# EAGLE design okenkovy diskriminator (EAGLE 7.7.0)
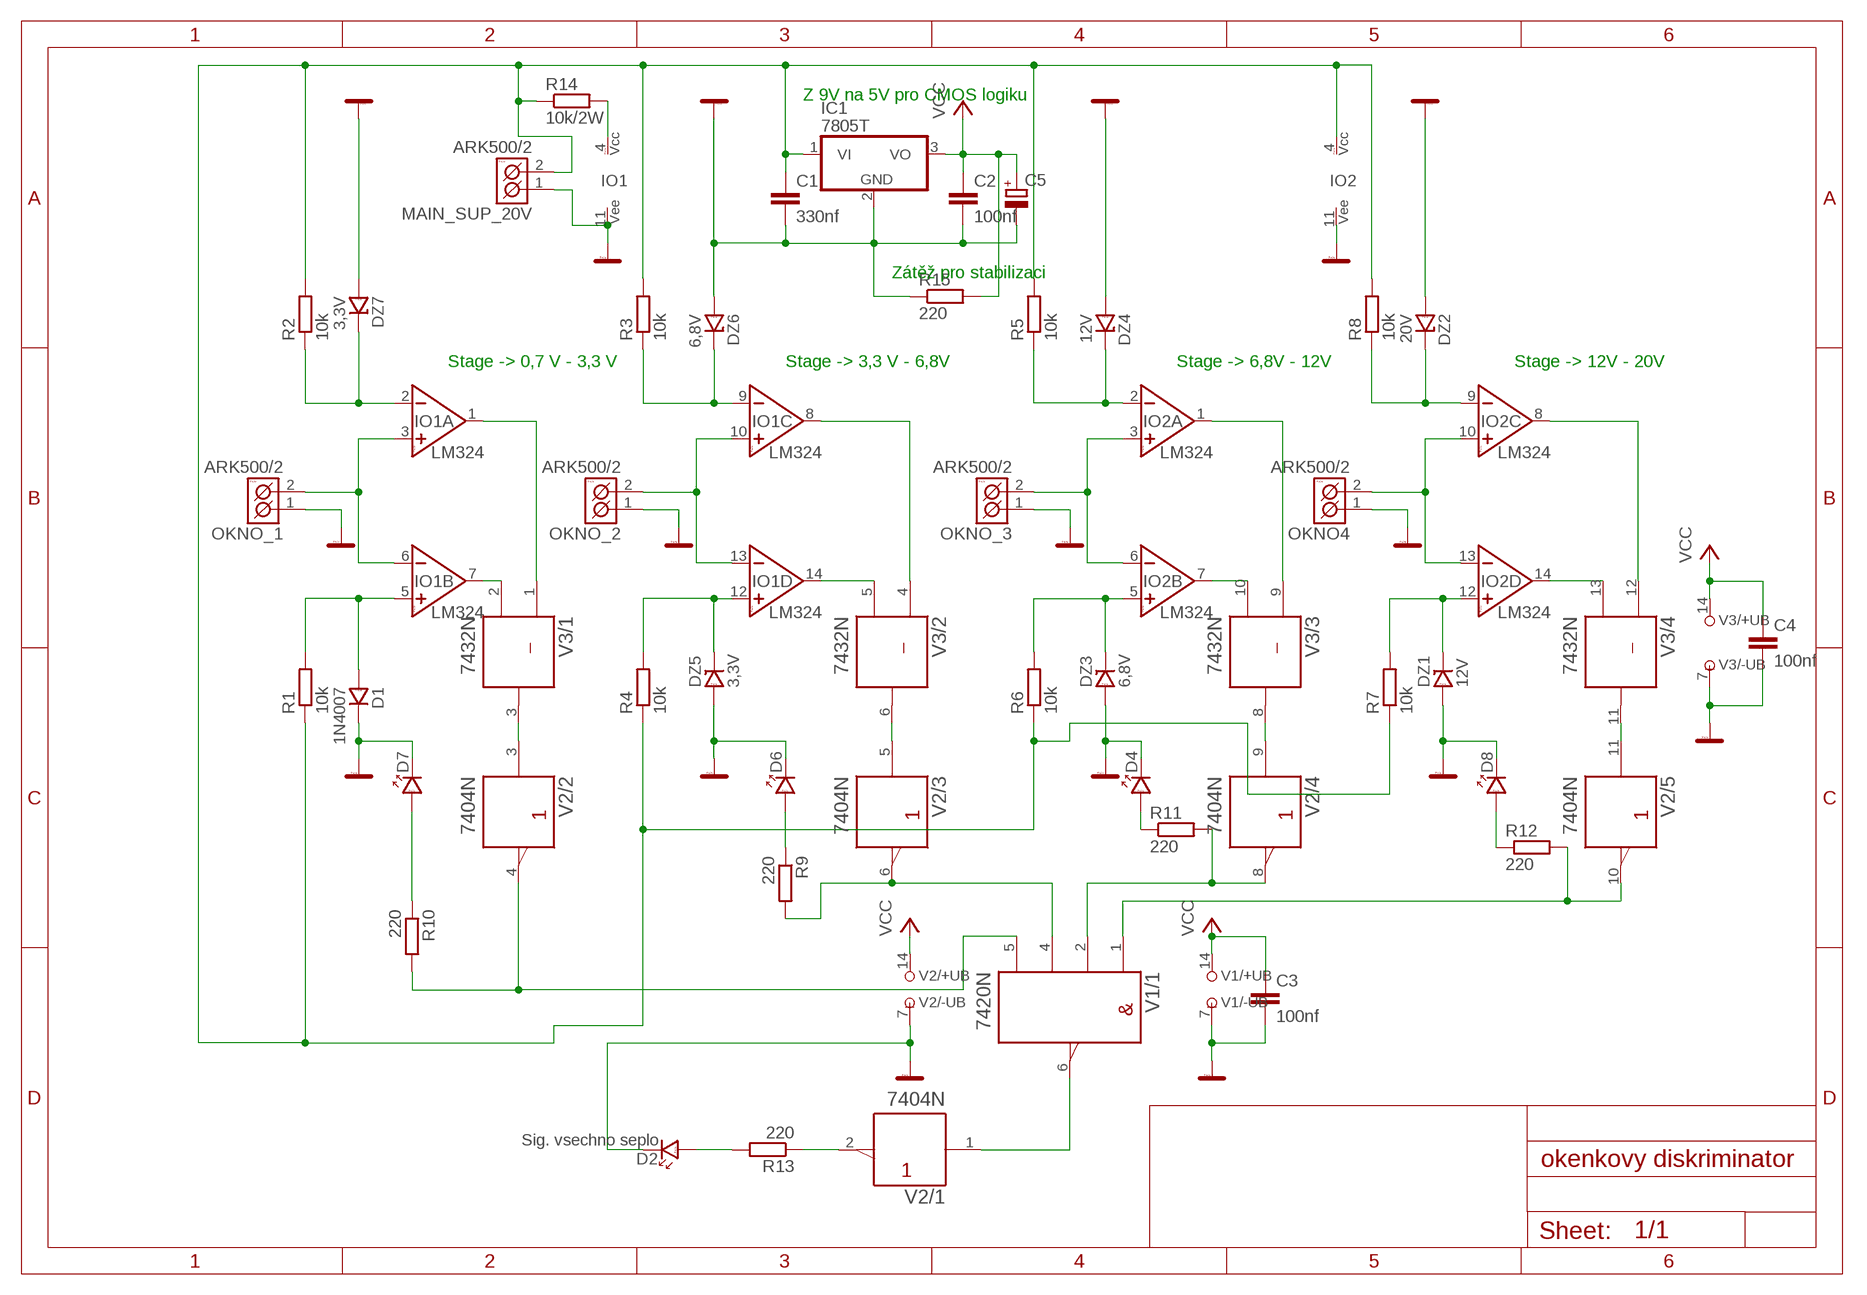
[diagram p0: schematic, sheet 1]

## Parts
C1  330nf  C-EU050-030X075  [C050-030X075]
C2  100nf  C-EU050-030X075  [C050-030X075]
C3  100nf  C-EU050-025X075  [C050-025X075]
C4  100nf  C-EU050-025X075  [C050-025X075]
C5  CPOL-EUE2.5-5  [E2,5-5]
D1  1N4007  [DO41]
D2  Sig. vsechno seplo  LED_5  [LED_5]
D4  LED_5  [LED_5]
D6  LED_5  [LED_5]
D7  LED_5  [LED_5]
D8  LED_5  [LED_5]
DZ1  12V  D-BZX85V_1,3W-ZENER  [DO35]
DZ2  20V  D-BZX85V_1,3W-ZENER  [DO35]
DZ3  6,8V  D-BZX85V_1,3W-ZENER  [DO35]
DZ4  12V  D-BZX85V_1,3W-ZENER  [DO35]
DZ5  3,3V  D-BZX85V_1,3W-ZENER  [DO35]
DZ6  6,8V  D-BZX85V_1,3W-ZENER  [DO35]
DZ7  3,3V  D-BZX85V_1,3W-ZENER  [DO35]
IC1  7805T  [TO220H]
IO1  LM324  [DIL14]
IO2  LM324  [DIL14]
MAIN_SUP_20V  ARK500/2  [ARK500/2]
OKNO4  ARK500/2  [ARK500/2]
OKNO_1  ARK500/2  [ARK500/2]
OKNO_2  ARK500/2  [ARK500/2]
OKNO_3  ARK500/2  [ARK500/2]
R1  10k  R-EU_0207/10  [0207/10]
R2  10k  R-EU_0207/10  [0207/10]
R3  10k  R-EU_0207/10  [0207/10]
R4  10k  R-EU_0207/10  [0207/10]
R5  10k  R-EU_0207/10  [0207/10]
R6  10k  R-EU_0207/10  [0207/10]
R7  10k  R-EU_0207/10  [0207/10]
R8  10k  R-EU_0207/10  [0207/10]
R9  220  R-EU_0207/10  [0207/10]
R10  220  R-EU_0207/10  [0207/10]
R11  220  R-EU_0207/10  [0207/10]
R12  220  R-EU_0207/10  [0207/10]
R13  220  R-EU_0207/10  [0207/10]
R14  10k/2W  R-EU_0414/15  [0414/15]
R15  220  R-EU_0207/10  [0207/10]
V1  7420N  [DIL14]
V2  7404N  [DIL14]
V3  7432N  [DIL14]

## Nets
GND: C1.2 C2.2 C3.2 C4.2 C5.- D1.K D2.K D4.K D6.K D7.K D8.K DZ1.A DZ2.A DZ3.A DZ4.A DZ5.A DZ6.A DZ7.A IC1.2(GND) IO1.11(POWER:VEE) IO2.11(POWER:VEE) MAIN_SUP_20V.1(K1) OKNO4.1(K1) OKNO_1.1(K1) OKNO_2.1(K1) OKNO_3.1(K1) R15.1 V1.7(/-UB:-UB) V2.7(/-UB:-UB) V3.7(/-UB:-UB)
N$1: D1.A IO1.5(B:NEIN+) R1.2
N$2: DZ7.K IO1.2(A:IN-) R2.1
N$3: DZ6.K IO1.9(C:IN-) R3.1
N$4: DZ5.K IO1.12(D:NEIN+) R4.2
N$5: DZ3.K IO2.5(B:NEIN+) R6.2
N$6: DZ4.K IO2.2(A:IN-) R5.1
N$7: DZ1.K IO2.12(D:NEIN+) R7.2
N$8: DZ2.K IO2.9(C:IN-) R8.1
N$9: IO1.3(A:NEIN+) IO1.6(B:IN-) OKNO_1.2(K2)
N$10: IO1.10(C:NEIN+) IO1.13(D:IN-) OKNO_2.2(K2)
N$11: IO2.3(A:NEIN+) IO2.6(B:IN-) OKNO_3.2(K2)
N$12: IO2.10(C:NEIN+) IO2.13(D:IN-) OKNO4.2(K2)
N$13: IO1.1(A:VYSTUP) V3.1(/1:A)
N$14: D7.A R10.1
N$15: IO1.7(B:VYSTUP) V3.2(/1:B)
N$16: D6.A R9.1
N$17: IO1.8(C:VYSTUP) V3.4(/2:A)
N$18: D4.A R11.1
N$19: IO1.14(D:VYSTUP) V3.5(/2:B)
N$20: D8.A R12.1
N$21: IO2.1(A:VYSTUP) V3.9(/3:A)
N$22: R13.1 V2.2(/1:Y)
N$23: IO2.7(B:VYSTUP) V3.10(/3:B)
N$24: D2.A R13.2
N$25: IO2.8(C:VYSTUP) V3.12(/4:A)
N$27: IO2.14(D:VYSTUP) V3.13(/4:B)
N$28: V2.11(/5:A) V3.11(/4:Y)
N$29: V2.9(/4:A) V3.8(/3:Y)
N$30: R9.2 V1.4(/1:C) V2.6(/3:Y)
N$31: V2.5(/3:A) V3.6(/2:Y)
N$32: R10.2 V1.5(/1:D) V2.4(/2:Y)
N$33: IO1.4(POWER:VCC) R14.2
N$34: R11.2 V1.2(/1:B) V2.8(/4:Y)
N$35: R12.2 V1.1(/1:A) V2.10(/5:Y)
N$36: V2.3(/2:A) V3.3(/1:Y)
N$37: V1.6(/1:Y) V2.1(/1:A)
N$38: C1.1 IC1.1(VI) IO2.4(POWER:VCC) MAIN_SUP_20V.2(K2) R1.1 R2.2 R3.2 R4.1 R5.2 R6.1 R7.1 R8.2 R14.1
VCC: C2.1 C3.1 C4.1 C5.+ IC1.3(VO) R15.2 V1.14(/+UB:+UB) V2.14(/+UB:+UB) V3.14(/+UB:+UB)
Unconnected: V1.8(/2:Y) V1.9(/2:A) V1.10(/2:B) V1.12(/2:C) V1.13(/2:D) V2.12(/6:Y) V2.13(/6:A)

## Notes on the sheet
- Z 9V na 5V pro CMOS logiku
- Zátěž pro stabilizaci
- Stage -> 0,7 V - 3,3 V | Stage -> 3,3 V - 6,8V | Stage -> 6,8V - 12V | Stage -> 12V - 20V

## Library data of the parts
C1-C4 = rcl:C-EU: CAPACITOR, European symbol
C5 = rcl:CPOL-EU: POLARIZED CAPACITOR, European symbol
D1 = #PaJa_31:1N4007: Usmernovaci dioda - 1A, 1000V
D2 D4 D6-D8 = #PaJa_31:LED: LED - jednobarevna
DZ1-DZ7 = #PaJa_31:D-?-ZENER: Zenerova dioda
IC1 = linear:78*: Positive VOLTAGE REGULATOR Source: http://cache.national.com/ds/LM/LM78L05.pdf http://www.fairchildsemi.com/ds/LM/LM7805.pdf
IO1 IO2 = #PaJa_31:LM324: OZ - 4x, bipolární
MAIN_SUP_20V OKNO4 OKNO_1-OKNO_3 = #PaJa_konektory:ARK500/2: Svorkovnice - roztec 5mm - dvojita
R1-R15 = rcl:R-EU_: RESISTOR, European symbol
V1 = 74ttl-din:74*20: Dual 4-input NAND gate
V2 = 74ttl-din:74*04: Hex INVERTER
V3 = 74ttl-din:74*32: Quad 2-input OR gate

## Board
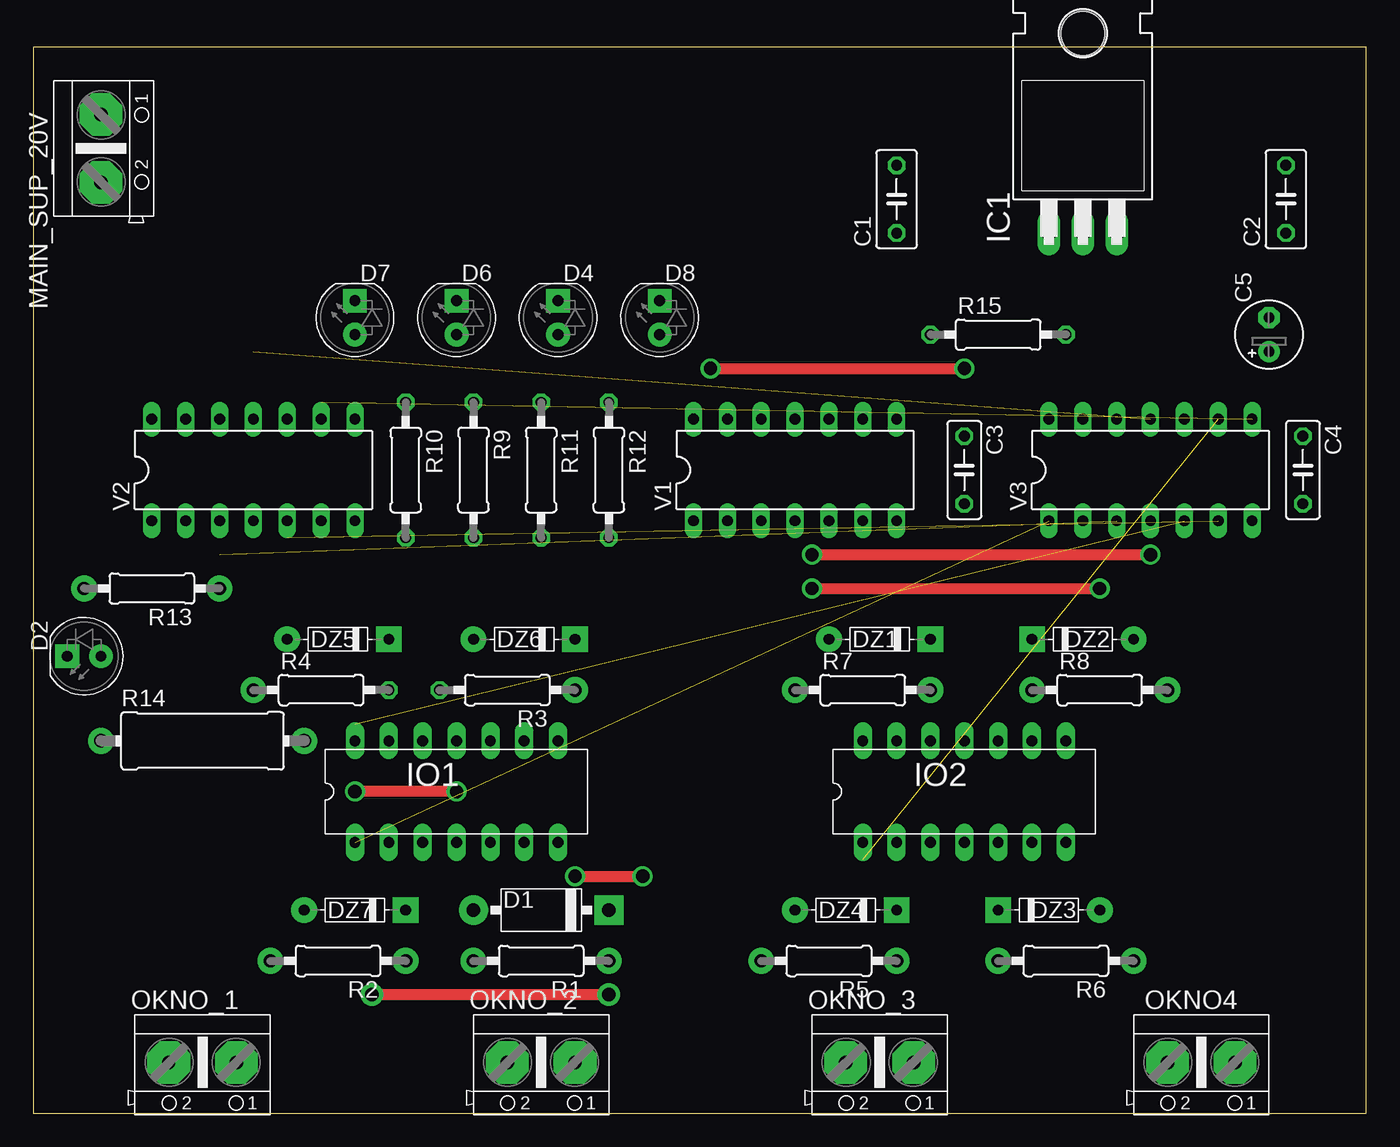
[diagram p1: board, top side]
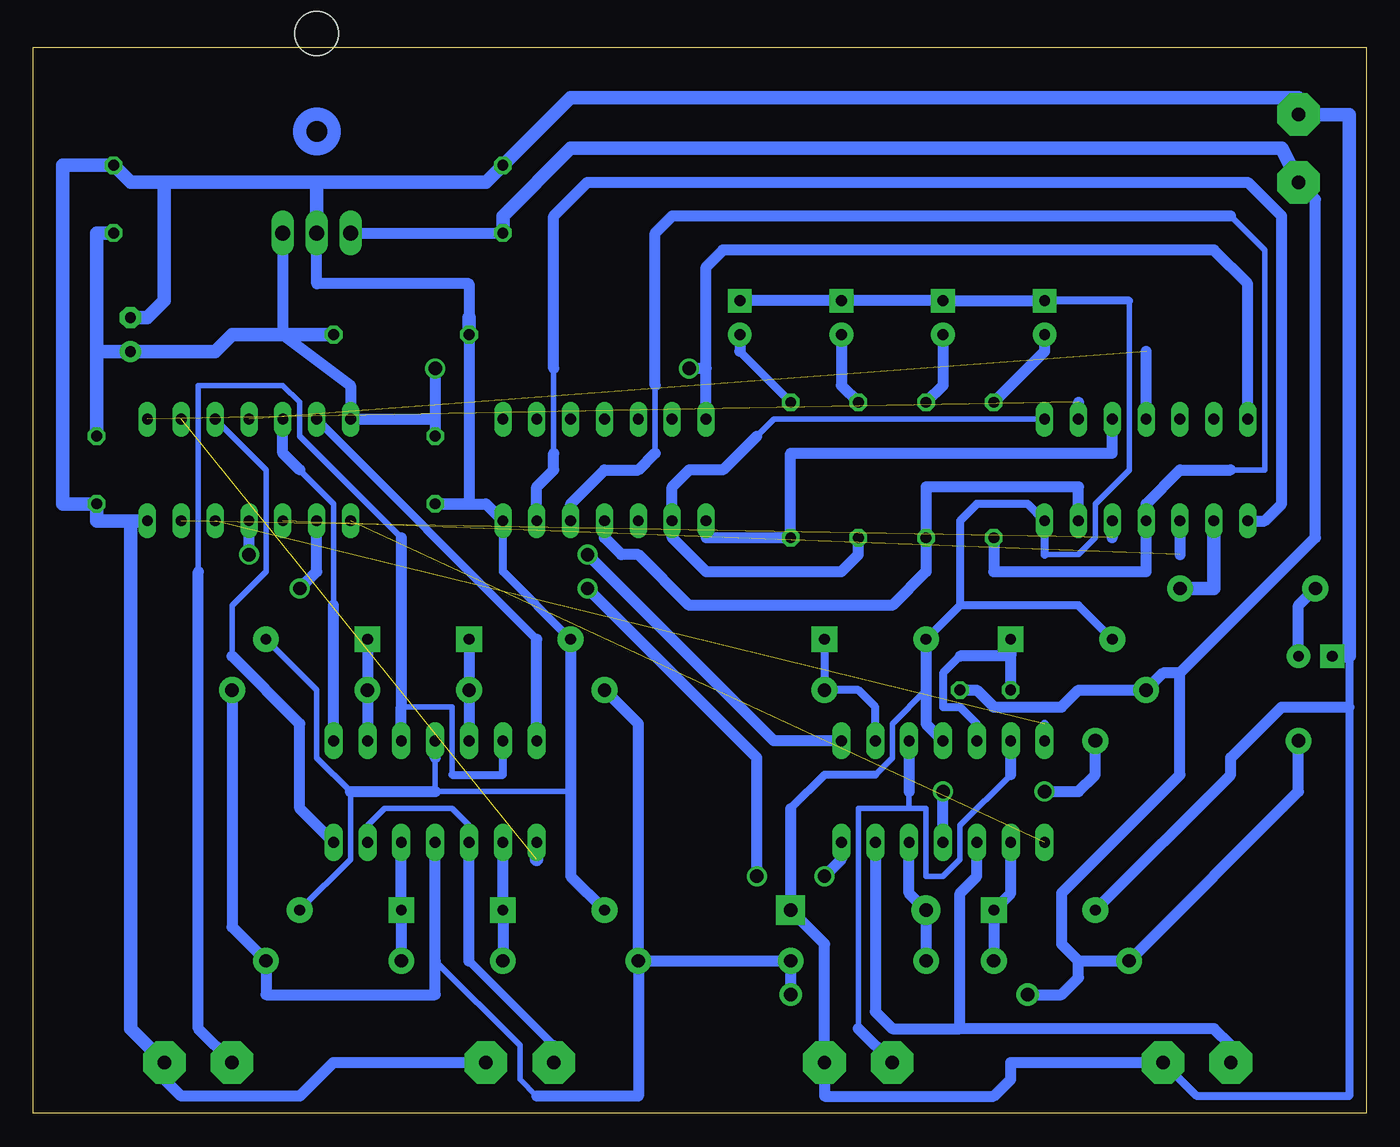
[diagram p2: board, bottom side, seen from below]

Size 100 x 80 mm. Coordinates in mm from the lower left corner, seen from the top.
Outline: 0,0 100,0 100,80 0,80 0,0
Copper layers (1*16): Top 0.035mm / dielectric 1.5mm / Bottom 0.035mm
Design rules "default": minimum track width 10mil, minimum drill 24mil, track to track 8mil, track to pad 8mil, pad to pad 8mil, via to via 8mil, smd to smd 8mil, copper to edge 40mil, drill to drill 8mil, minimum pad ring 10mil, minimum via ring 8mil, stop-mask expansion 4mil, vias tented up to drill 0mil, thermal gap 10mil

### Footprints (pad centres in the part's own frame; a part is rotated, then mirrored left to right if it is on the bottom)
C050-030X075 = drill 0.813 octagon: 1 -2.54,0; 2 2.54,0
C050-025X075 = drill 0.813 octagon: 1 -2.54,0; 2 2.54,0
E2,5-5 = drill 0.813 pad 1.6: + -1.27,0 | drill 0.813 pad 1.6 octagon: - 1.27,0
DO41 = drill 1.016 pad 2.184: A -5.08,0 | drill 1.016 pad 2.184 square: K 5.08,0
LED_5 = drill 0.813 pad 1.778: A -1.27,0 | drill 0.813 pad 1.778 square: K 1.27,0
DO35 = drill 0.813 pad 1.93: A -3.81,0 | drill 0.813 pad 1.93 square: K 3.81,0
TO220H = drill 1.118 long: 1 -2.54,-10.16; 2 0,-10.16; 3 2.54,-10.16 | hole 3.302: 0,4.826
DIL14 = drill 0.813 pad 1.4 long: 1 -7.62,-3.81; 2 -5.08,-3.81; 3 -2.54,-3.81; 4 0,-3.81; 5 2.54,-3.81; 6 5.08,-3.81; 7 7.62,-3.81; 8 7.62,3.81; 9 5.08,3.81; 10 2.54,3.81; 11 0,3.81; 12 -2.54,3.81; 13 -5.08,3.81; 14 -7.62,3.81
ARK500/2 = drill 1 pad 3.2 octagon: 1 -2.54,0; 2 2.54,0
0207/10 = drill 0.813 octagon: 1 -5.08,0; 2 5.08,0
0414/15 = drill 1.016 octagon: 1 -7.62,0; 2 7.62,0
DIL14' = drill 0.813 long: 1 -7.62,-3.81; 2 -5.08,-3.81; 3 -2.54,-3.81; 4 0,-3.81; 5 2.54,-3.81; 6 5.08,-3.81; 7 7.62,-3.81; 8 7.62,3.81; 9 5.08,3.81; 10 2.54,3.81; 11 0,3.81; 12 -2.54,3.81; 13 -5.08,3.81; 14 -7.62,3.81

### Placement (x,y rotation side)
C1  64.77,68.58 90 top
C2  93.98,68.58 90 top
C3  69.85,48.26 270 top
C4  95.25,48.26 270 top
C5  92.71,58.42 90 top
D1  38.1,15.24 0 top
D2  3.81,34.29 180 top
D4  39.37,59.69 90 top
D6  31.75,59.69 90 top
D7  24.13,59.69 90 top
D8  46.99,59.69 90 top
DZ1  63.5,35.56 0 top
DZ2  78.74,35.56 180 top
DZ3  76.2,15.24 180 top
DZ4  60.96,15.24 0 top
DZ5  22.86,35.56 0 top
DZ6  36.83,35.56 0 top
DZ7  24.13,15.24 0 top
IC1  78.74,76.2 0 top
IO1  31.75,24.13 0 top
IO2  69.85,24.13 0 top
MAIN_SUP_20V  5.08,72.39 270 top
OKNO4  87.63,3.81 180 top
OKNO_1  12.7,3.81 180 top
OKNO_2  38.1,3.81 180 top
OKNO_3  63.5,3.81 180 top
R1  38.1,11.43 180 top
R2  22.86,11.43 180 top
R3  35.56,31.75 180 top
R4  21.59,31.75 0 top
R5  59.69,11.43 180 top
R6  77.47,11.43 180 top
R7  62.23,31.75 0 top
R8  80.01,31.75 0 top
R9  33.02,48.26 270 top
R10  27.94,48.26 270 top
R11  38.1,48.26 270 top
R12  43.18,48.26 270 top
R13  8.89,39.37 180 top
R14  12.7,27.94 0 top
R15  72.39,58.42 0 top
V1  7420N  [DIL14']  57.15,48.26 0 top
V2  7404N  [DIL14']  16.51,48.26 0 top
V3  7432N  [DIL14']  83.82,48.26 0 top

### Tracks (layer width: path | path; a pad name or v marks a point on that pad's centre or on a via)
GND
  Bottom 0.406: 17.78,60.96 17.78,48.26 20.32,45.72 20.32,43.18 21.59,41.91 24.13,41.91 | 33.02,31.75 35.56,29.21 35.56,26.67 36.83,25.4 | DZ3.A 76.2,19.05 76.2,24.13 78.74,26.67 78.74,31.75 DZ2.A | 69.85,26.67 69.85,24.13 59.69,24.13
  Bottom 0.61: DZ6.A 30.48,38.1 | 17.78,60.96 D7.K | 24.13,41.91 V2.7 25.4,45.72 29.21,45.72 30.48,44.45 30.48,38.1 | V1.7 64.77,40.64 DZ1.A | OKNO_1.1 12.7,1.27 1.27,1.27 1.27,30.48 1.27,34.29 | DZ5.A 21.59,38.1 30.48,38.1 | 36.83,25.4 40.64,25.4 43.18,22.86
  Bottom 0.813: OKNO_1.1 26.67,3.81 26.67,2.54 27.94,1.27 40.64,1.27 OKNO_2.1 40.64,12.7 D1.K 43.18,22.86 | D7.K D6.K D4.K D8.K | IO1.11 33.02,29.21 33.02,31.75 DZ6.A | OKNO_3.1 77.47,3.81 80.01,1.27 88.9,1.27 90.17,2.54 OKNO4.1 | 69.85,26.67 IO2.11 | 76.2,24.13 69.85,24.13 | V1.7 66.04,45.72 C3.2 67.31,45.72 R15.1 | DZ4.A 59.69,17.78 59.69,24.13 DZ1.A | 67.31,59.69 67.31,62.23 78.74,62.23 IC1.2 | DZ7.A 10.16,25.4 10.16,26.67 6.35,30.48 1.27,30.48
  Bottom 1.016: 92.71,44.45 95.25,44.45 C4.2 97.79,45.72 97.79,71.12 C2.2 92.71,69.85 90.17,69.85 | 92.71,44.45 V3.7 | D2.K 1.27,34.29 1.27,74.93 MAIN_SUP_20V.1 5.08,76.2 59.69,76.2 C1.2 66.04,69.85 78.74,69.85 | OKNO4.1 92.71,6.35 92.71,44.45 | IC1.2 78.74,69.85 | 90.17,69.85 78.74,69.85 | R15.1 67.31,59.69 | C5.- 91.44,59.69 90.17,60.96 90.17,69.85
N$1
  Bottom 0.813: R1.2 D1.A 34.29,16.51 IO1.5
N$2
  Bottom 0.813: R2.1 DZ7.K 26.67,16.51 IO1.2
N$3
  Bottom 0.61: DZ6.K R3.1 38.1,31.75 36.83,30.48 IO1.9
N$4
  Bottom 0.61: 30.48,34.29 31.75,33.02 31.75,30.48 30.48,30.48 29.21,29.21 IO1.12
  Bottom 0.813: DZ5.K 26.67,34.29 | R4.2 26.67,34.29 | 26.67,34.29 30.48,34.29
N$5
  Bottom 0.813: R6.2 DZ3.K IO2.5
N$6
  Bottom 0.813: R5.1 DZ4.K IO2.2
N$7
  Bottom 0.813: DZ1.K R7.2 IO2.12
N$8
  Bottom 0.813: DZ2.K R8.1 IO2.9
N$9
  Bottom 0.813: OKNO_1.2 10.16,5.08 11.43,6.35 30.48,6.35 | 30.48,6.35 30.48,16.51 29.21,17.78 IO1.3 | IO1.6 36.83,7.62 35.56,6.35 30.48,6.35
N$10
  Bottom 0.406: 26.67,25.4 30.48,21.59 30.48,19.05 31.75,17.78 33.02,17.78 33.02,22.86 34.29,22.86 | 34.29,24.13 34.29,22.86 | 34.29,22.86 38.1,22.86 38.1,6.35
  Bottom 0.813: 26.67,25.4 IO1.13 | IO1.10 34.29,24.13 | 38.1,6.35 OKNO_2.2
N$11
  Bottom 0.406: IO2.3 67.31,21.59 68.58,22.86 73.66,22.86 74.93,21.59 IO2.6
  Bottom 0.61: 60.96,5.08 67.31,11.43
  Bottom 0.813: OKNO_3.2 60.96,5.08 | 67.31,11.43 IO2.3
N$12
  Bottom 0.406: 68.58,25.4 68.58,30.48 72.39,30.48 | 72.39,43.18 80.01,50.8 80.01,53.34 81.28,54.61 87.63,54.61 87.63,40.64
  Bottom 0.61: IO2.13 64.77,25.4 68.58,25.4
  Bottom 0.813: IO2.10 72.39,30.48 72.39,43.18 | OKNO4.2 87.63,6.35 87.63,40.64
N$13  (1 unrouted)
N$14
  Bottom 0.813: R10.1 24.13,57.15 D7.A
N$15  (via drill 1 pad 1.42)
  Top 0.813: v40.64,17.78 v45.72,17.78 | v58.42,39.37 v80.01,39.37
  Bottom 0.813: IO1.7 39.37,19.05 v40.64,17.78 | v45.72,17.78 45.72,26.67 v58.42,39.37 | v80.01,39.37 78.74,40.64 V3.2
N$16
  Bottom 0.813: R9.1 31.75,54.61 D6.A
N$17  (via drill 1 pad 1.42)
  Top 0.813: v58.42,41.91 v83.82,41.91
  Bottom 0.813: IO1.8 44.45,27.94 v58.42,41.91 | v83.82,41.91 V3.4
N$18
  Bottom 0.813: R11.1 39.37,54.61 D4.A
N$19  (1 unrouted)
  Bottom 0.61: IO1.14 24.13,29.21
N$20
  Bottom 0.61: 46.99,57.15 R12.1
  Bottom 0.813: D8.A 46.99,57.15
N$21  (1 unrouted)
  Bottom 1.016: IO2.1 62.23,19.05
N$22
  Bottom 1.016: V2.2 11.43,39.37 R13.1
N$23
  Bottom 0.406: 85.09,34.29 85.09,38.1 82.55,40.64 82.55,48.26 V3.10
  Bottom 0.813: 85.09,34.29 80.01,29.21 80.01,22.86 IO2.7
N$24
  Bottom 0.813: D2.A 5.08,38.1 R13.2
N$25
  Bottom 0.406: 77.47,38.1 77.47,45.72 80.01,48.26
  Bottom 0.813: V3.12 81.28,49.53 80.01,48.26 | IO2.8 77.47,38.1
N$26  (via drill 1 pad 1.42)
  other vias: 24.13,24.13
N$27
  Bottom 0.61: 62.23,35.56 V3.13
  Bottom 0.813: IO2.14 62.23,35.56
N$28  (1 unrouted)
  Bottom 0.813: V2.11 16.51,57.15
N$29  (1 unrouted)
  Bottom 0.813: V2.9 21.59,53.34
N$30
  Bottom 0.813: V2.6 21.59,46.99 33.02,46.99 R9.2 33.02,40.64 35.56,38.1 50.8,38.1 54.61,41.91 55.88,41.91 57.15,43.18 V1.4
N$31  (1 unrouted)
  Bottom 0.813: V2.5 19.05,43.18
N$32
  Bottom 0.254: 53.34,50.8 53.34,66.04
  Bottom 0.406: 10.16,48.26 7.62,48.26 7.62,64.77 10.16,67.31 | 53.34,49.53 53.34,50.8 53.34,54.61
  Bottom 0.813: R10.2 27.94,40.64 16.51,40.64 V2.4 16.51,45.72 13.97,48.26 10.16,48.26 | V1.5 59.69,45.72 57.15,48.26 54.61,48.26 53.34,49.53 | 10.16,67.31 52.07,67.31 53.34,66.04 53.34,54.61
N$33  (via drill 1 pad 1.42)
  Top 0.813: v31.75,24.13 v24.13,24.13
  Bottom 0.813: IO1.4 v31.75,24.13 | v24.13,24.13 21.59,24.13 20.32,25.4 R14.2
N$34
  Bottom 0.406: V2.8 44.45,52.07 45.72,50.8
  Bottom 0.813: 45.72,50.8 48.26,48.26 50.8,48.26 52.07,46.99 V1.2 52.07,43.18 49.53,40.64 39.37,40.64 38.1,41.91 R11.2
N$35
  Bottom 0.813: V1.1 49.53,43.18 R12.2 43.18,49.53 19.05,49.53 V2.10
N$36  (1 unrouted)
  Bottom 0.813: V2.3 13.97,41.91
N$37
  Bottom 0.406: 60.96,49.53 60.96,55.88
  Bottom 0.813: V1.6 62.23,46.99 60.96,48.26 60.96,49.53 | 60.96,55.88 60.96,67.31 58.42,69.85 8.89,69.85 6.35,67.31 6.35,45.72 7.62,44.45 V2.1
N$38  (via drill 1 pad 1.68)
  Top 0.813: v43.18,8.89 v25.4,8.89
  Bottom 0.406: 69.85,11.43 63.5,5.08 63.5,2.54 62.23,1.27
  Bottom 0.813: R8.2 85.09,13.97 R6.1 82.55,8.89 69.85,8.89 69.85,11.43 IO2.4 | IC1.1 C1.1 | R5.2 R1.1 v43.18,8.89 | R7.1 54.61,29.21 R5.2 | 62.23,1.27 54.61,1.27 R5.2 | 13.97,33.02 3.81,43.18 3.81,68.58 MAIN_SUP_20V.2 | 13.97,33.02 13.97,25.4 22.86,16.51 22.86,12.7 21.59,11.43 | R14.1 5.08,24.13 R2.2 21.59,11.43 | v25.4,8.89 22.86,8.89 21.59,10.16 21.59,11.43 | 13.97,33.02 15.24,33.02 R4.1 21.59,31.75 22.86,30.48 27.94,30.48 29.21,31.75 R3.2
  Bottom 1.016: C1.1 64.77,67.31 59.69,72.39 6.35,72.39 MAIN_SUP_20V.2
N$39  (via drill 1 pad 1.42)
  other vias: 31.75,24.13
N$40  (via drill 1 pad 1.42)
  other vias: 50.8,55.88
N$41  (via drill 1 pad 1.42)
  other vias: 69.85,55.88
N$42  (via drill 1 pad 1.42)
  other vias: 83.82,41.91
N$43  (via drill 1 pad 1.42)
  other vias: 58.42,41.91
N$44  (via drill 1 pad 1.42)
  other vias: 58.42,39.37
N$45  (via drill 1 pad 1.42)
  other vias: 40.64,17.78
N$46  (via drill 1 pad 1.42)
  other vias: 80.01,39.37
N$47  (via drill 1 pad 1.42)
  other vias: 45.72,17.78
N$48  (via drill 1 pad 1.93)
  other vias: 13.97,39.37
N$49  (via drill 1 pad 1.93)
  other vias: 3.81,39.37
N$50  (via drill 1 pad 1.93)
  other vias: 5.08,27.94
N$51  (via drill 1 pad 1.93)
  other vias: 20.32,27.94
N$52  (via drill 1 pad 1.93)
  other vias: 16.51,31.75
N$53  (via drill 1 pad 1.93)
  other vias: 16.51,31.75
N$54  (via drill 1 pad 1.93)
  other vias: 40.64,31.75
N$55  (via drill 1 pad 1.93)
  other vias: 57.15,31.75
N$56  (via drill 1 pad 1.93)
  other vias: 67.31,31.75
N$57  (via drill 1 pad 1.93)
  other vias: 74.93,31.75
N$58  (via drill 1 pad 1.93)
  other vias: 85.09,31.75
N$59  (via drill 1 pad 1.93)
  other vias: 43.18,11.43
N$60  (via drill 1 pad 1.93)
  other vias: 33.02,11.43
N$61  (via drill 1 pad 1.93)
  other vias: 17.78,11.43
N$62  (via drill 1 pad 1.93)
  other vias: 54.61,11.43
N$63  (via drill 1 pad 1.93)
  other vias: 64.77,11.43
N$64  (via drill 1 pad 1.93)
  other vias: 72.39,11.43
N$65  (via drill 1 pad 1.93)
  other vias: 82.55,11.43
N$66  (via drill 1 pad 1.93)
  other vias: 27.94,11.43
N$67  (via drill 1 pad 1.68)
  other vias: 25.4,8.89
N$68  (via drill 1 pad 1.68)
  other vias: 43.18,8.89
VCC  (via drill 1 pad 1.42)
  Top 0.813: v50.8,55.88 v69.85,55.88
  Bottom 0.813: 49.53,55.88 49.53,63.5 48.26,64.77 11.43,64.77 8.89,62.23 V2.14 | 69.85,52.07 V3.14 76.2,54.61 81.28,58.42 IC1.3 | V1.14 49.53,55.88 | 49.53,55.88 v50.8,55.88 | v69.85,55.88 69.85,52.07 | 69.85,52.07 C3.1
  Bottom 1.016: C2.1 95.25,66.04 95.25,57.15 | 95.25,57.15 C4.1 | R15.2 81.28,58.42 85.09,58.42 86.36,57.15 C5.+ 95.25,57.15
(copper drawn outside any net)
  shapes: Bottom circle x1